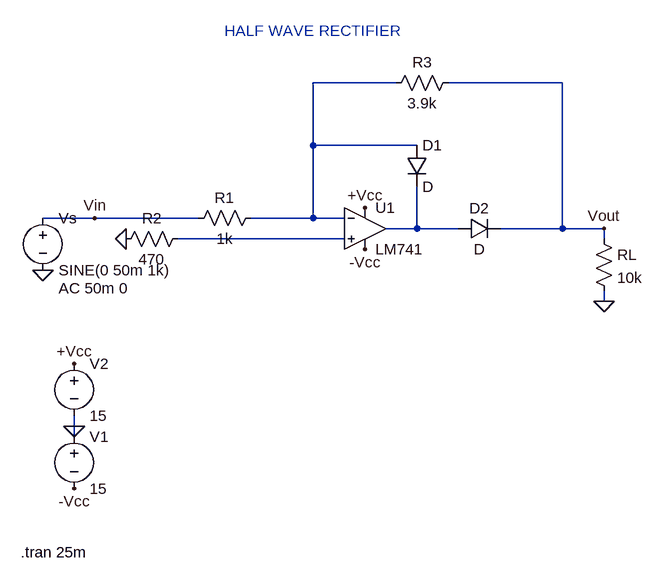
[diagram p0: schematic halfwave.asc]
halfwave.asc, the LTspice schematic file:
Version 4
SHEET 1 880 680
WIRE 352 -112 224 -112
WIRE 608 -112 432 -112
WIRE 224 -16 224 -112
WIRE 384 -16 224 -16
WIRE -112 96 -192 96
WIRE 48 96 -112 96
WIRE 224 96 224 -16
WIRE 224 96 128 96
WIRE 272 96 224 96
WIRE 384 112 384 48
WIRE 384 112 336 112
WIRE 448 112 384 112
WIRE 608 112 608 -112
WIRE 608 112 512 112
WIRE 672 112 608 112
WIRE 272 128 16 128
WIRE 672 128 672 112
WIRE 672 224 672 208
WIRE -144 416 -144 400
WIRE -144 432 -144 416
FLAG -64 128 0
FLAG 672 224 0
FLAG -192 176 0
FLAG -144 416 0
FLAG 304 80 +Vcc
FLAG 304 144 -Vcc
FLAG -144 320 +Vcc
FLAG -144 512 -Vcc
FLAG 672 112 Vout
FLAG -112 96 Vin
SYMBOL Opamps\\LM741 304 48 R0
SYMATTR InstName U1
SYMATTR SpiceModel ""
SYMBOL diode 448 128 R270
WINDOW 0 32 32 VTop 2
WINDOW 3 0 32 VBottom 2
SYMATTR InstName D2
SYMBOL res 144 80 R90
WINDOW 0 0 56 VBottom 2
WINDOW 3 32 56 VTop 2
SYMATTR InstName R1
SYMATTR Value 1k
SYMBOL res 32 112 R90
WINDOW 0 0 56 VBottom 2
WINDOW 3 32 56 VTop 2
SYMATTR InstName R2
SYMATTR Value 470
SYMBOL res 448 -128 R90
WINDOW 0 0 56 VBottom 2
WINDOW 3 32 56 VTop 2
SYMATTR InstName R3
SYMATTR Value 3.9k
SYMBOL diode 368 -16 R0
SYMATTR InstName D1
SYMBOL res 656 112 R0
SYMATTR InstName RL
SYMATTR Value 10k
SYMBOL voltage -144 416 R0
SYMATTR InstName V1
SYMATTR Value 15
SYMBOL voltage -144 304 R0
SYMATTR InstName V2
SYMATTR Value 15
SYMBOL voltage -192 80 R0
WINDOW 123 24 124 Left 2
WINDOW 39 0 0 Left 2
SYMATTR InstName Vs
SYMATTR Value SINE(0 50m 1k)
SYMATTR Value2 AC 50m 0
TEXT 88 -192 Left 2 ;HALF WAVE RECTIFIER
TEXT -226 610 Left 2 !.tran 25m

The netlist it stands for:
* halfwave.asc
XU1 N003 N001 +Vcc -Vcc N002 LM741  ; pins In+ In- V+ V- OUT
D2 N002 Vout D
R1 N001 Vin 1k
R2 N003 0 470
R3 Vout N001 3.9k
D1 N001 N002 D
RL Vout 0 10k
V1 0 -Vcc 15
V2 +Vcc 0 15
Vs Vin 0 SINE(0 50m 1k) AC 50m 0
.model D D
.lib standard.dio
* HALF WAVE RECTIFIER
.tran 25m
.lib LM741.lib
.backanno
.end